# EAGLE schematic Mainboard_LEFT (EAGLE 9.6.2)
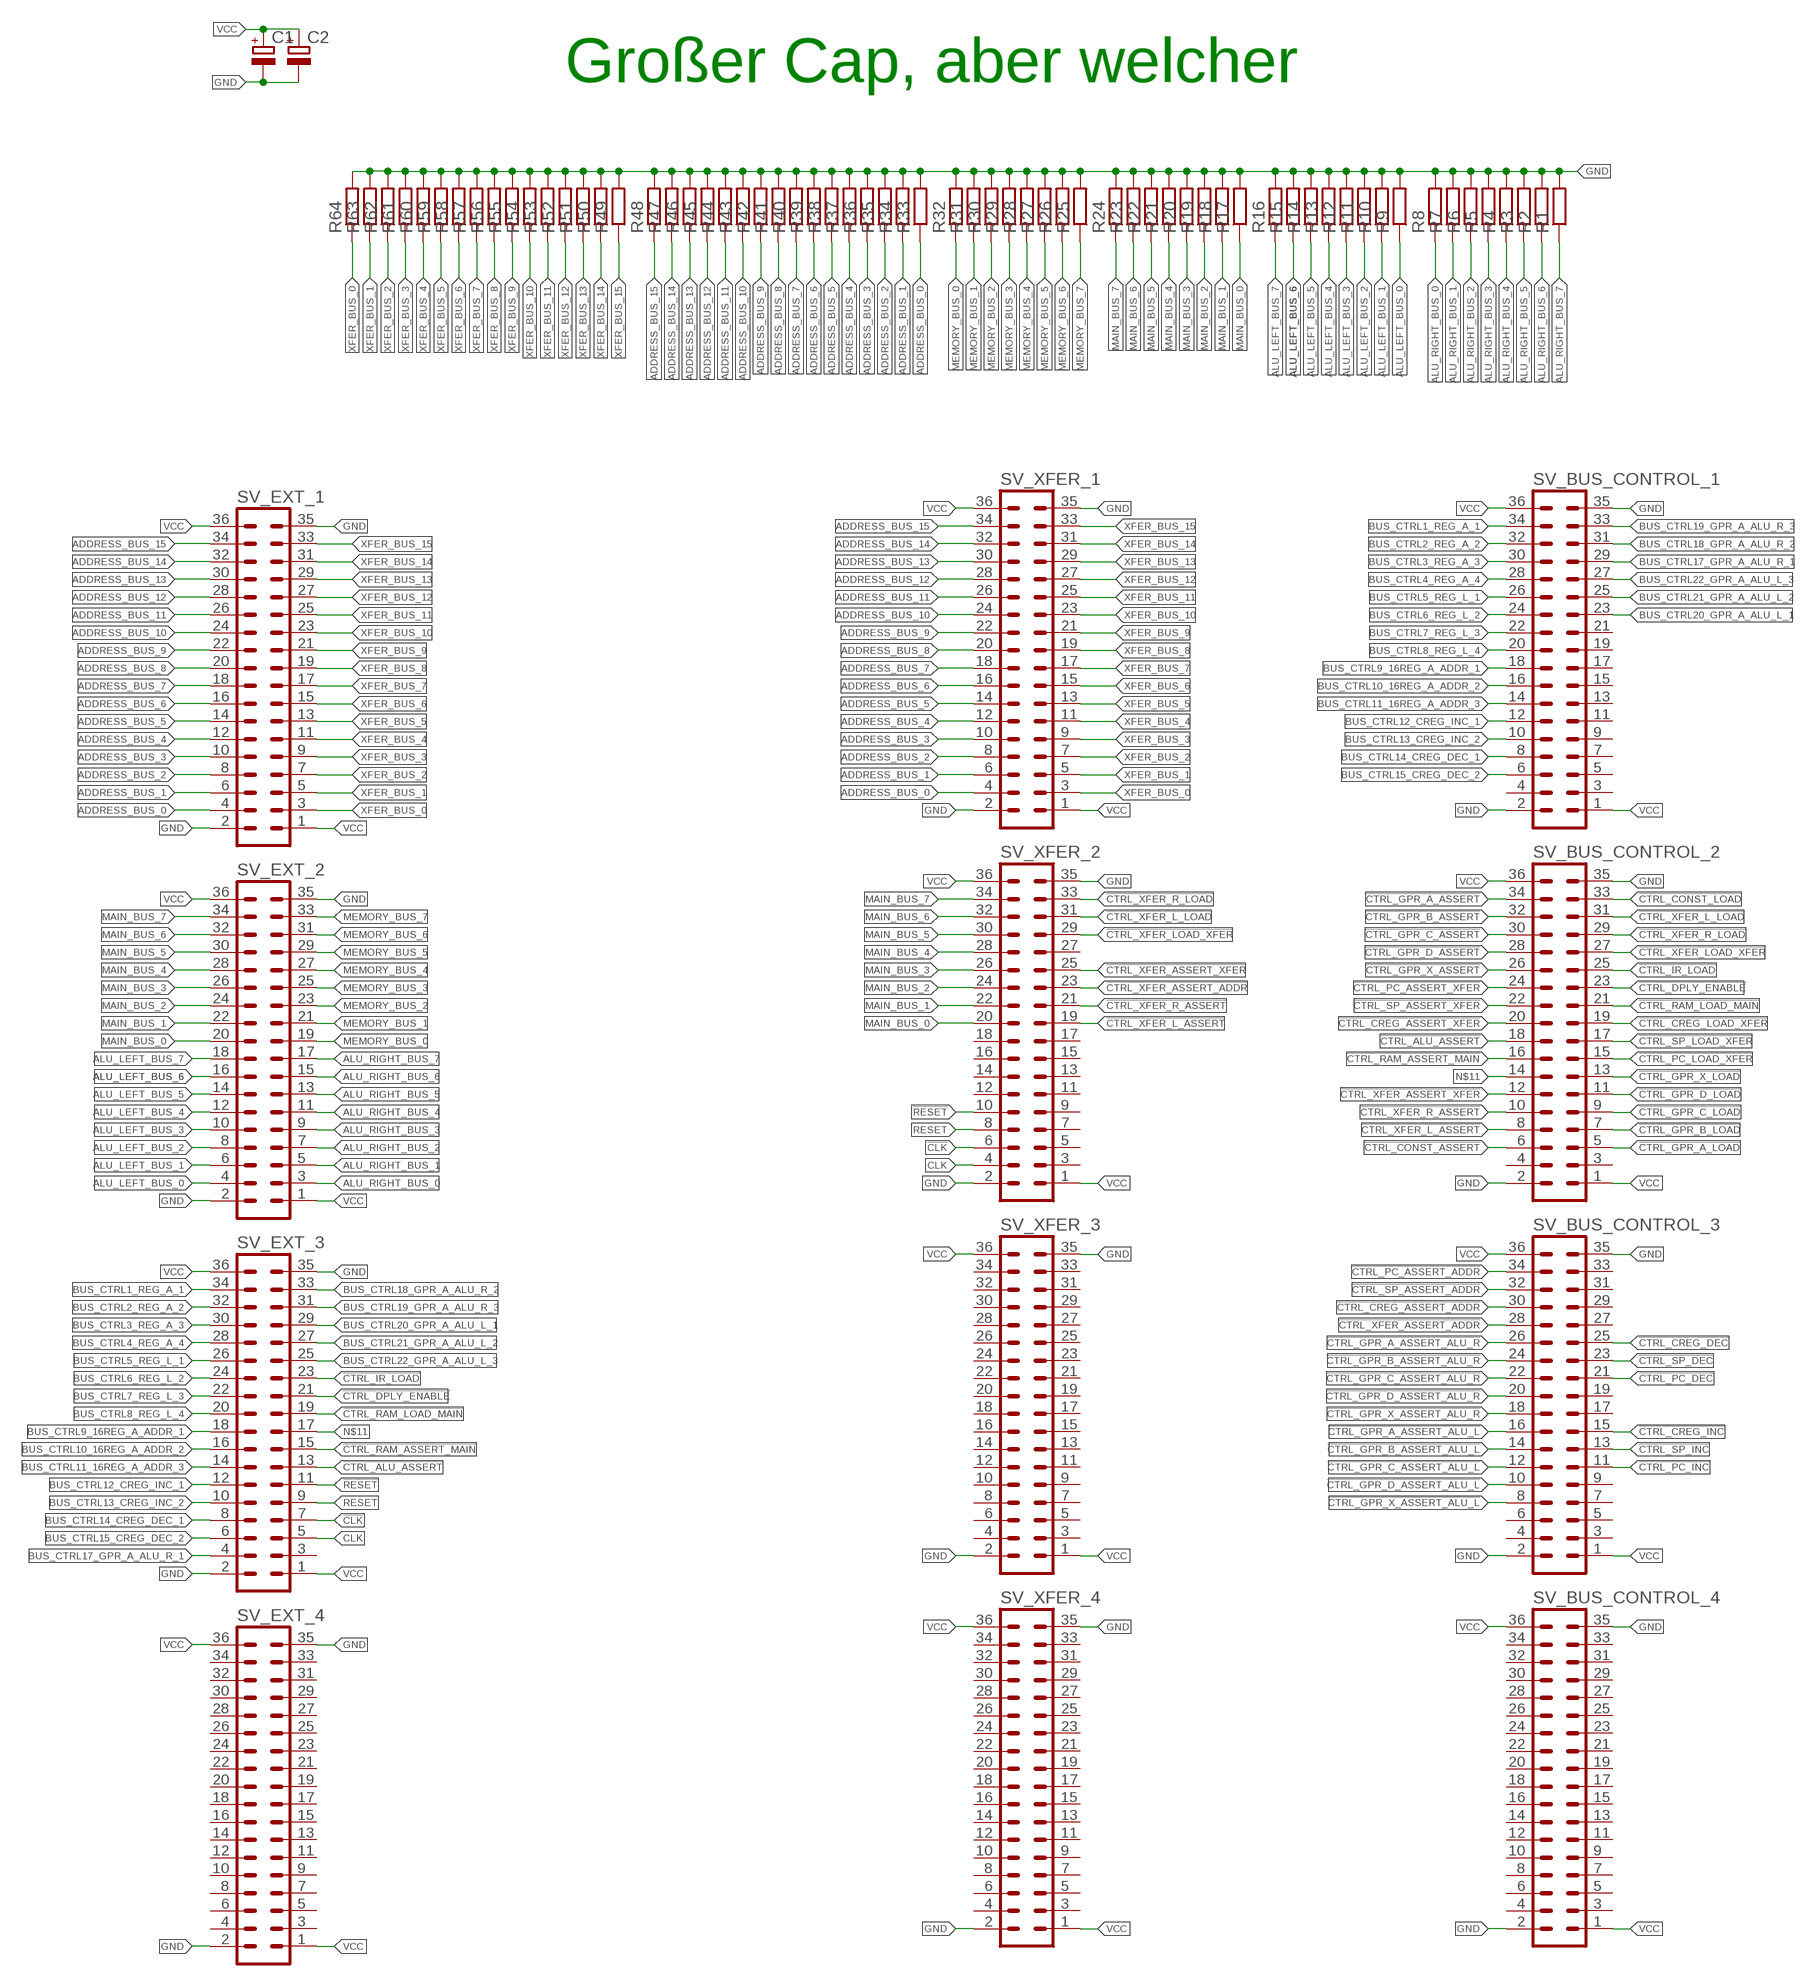
[diagram p0: schematic, sheet 1, part 1 of 2]
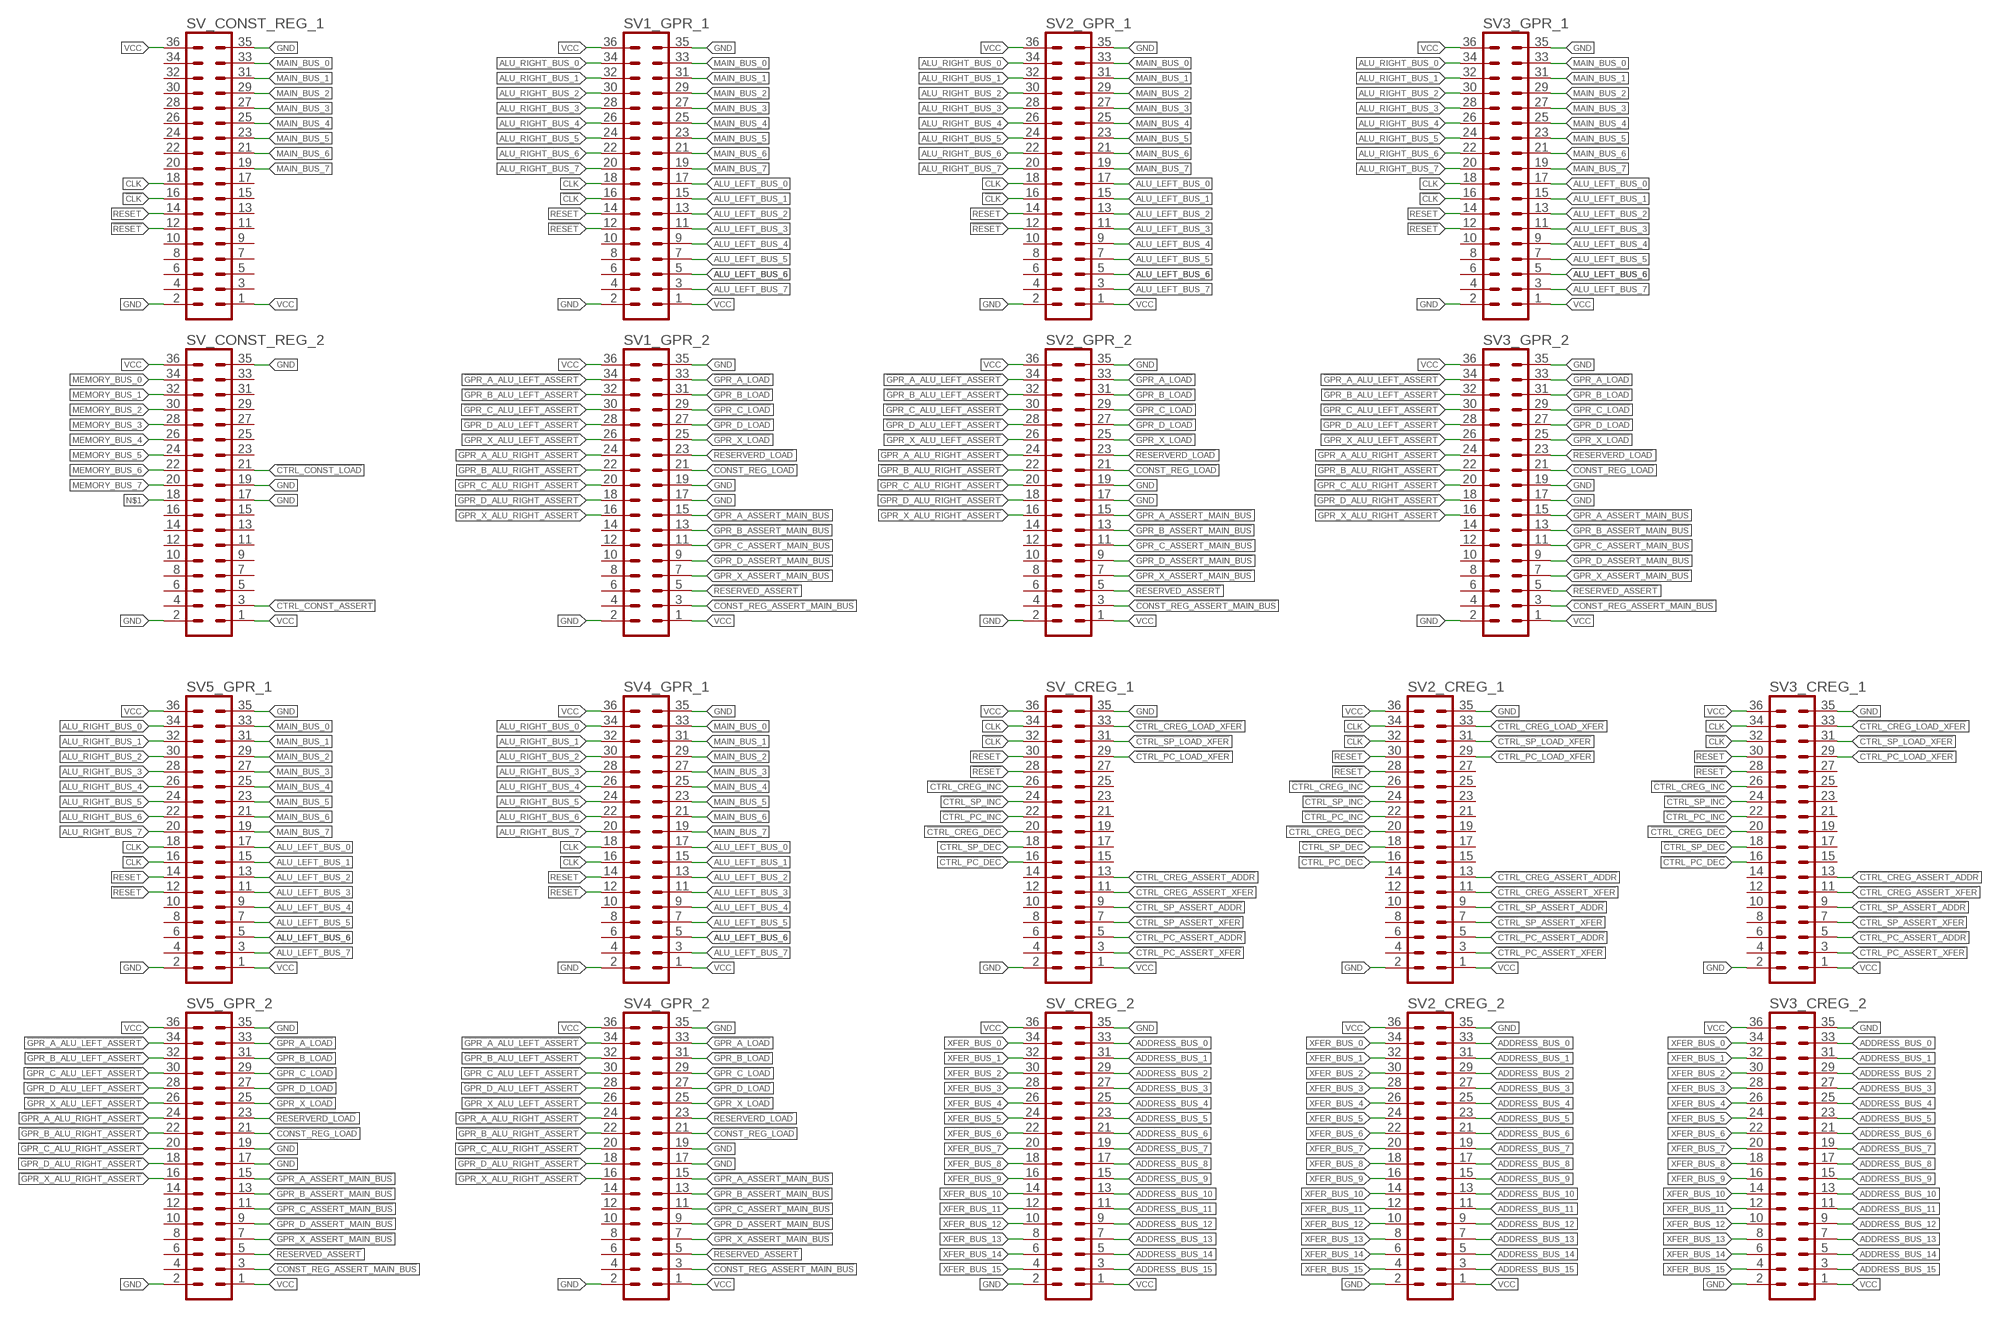
[diagram p1: schematic, sheet 1, part 2 of 2]

## Parts
C1  CPOL-EUE5-10.5  [E5-10,5]
C2  CPOL-EUE5-10.5  [E5-10,5]
R1  R-EU_R0805  [R0805]
R2  R-EU_R0805  [R0805]
R3  R-EU_R0805  [R0805]
R4  R-EU_R0805  [R0805]
R5  R-EU_R0805  [R0805]
R6  R-EU_R0805  [R0805]
R7  R-EU_R0805  [R0805]
R8  R-EU_R0805  [R0805]
R9  R-EU_R0805  [R0805]
R10  R-EU_R0805  [R0805]
R11  R-EU_R0805  [R0805]
R12  R-EU_R0805  [R0805]
R13  R-EU_R0805  [R0805]
R14  R-EU_R0805  [R0805]
R15  R-EU_R0805  [R0805]
R16  R-EU_R0805  [R0805]
R17  R-EU_R0805  [R0805]
R18  R-EU_R0805  [R0805]
R19  R-EU_R0805  [R0805]
R20  R-EU_R0805  [R0805]
R21  R-EU_R0805  [R0805]
R22  R-EU_R0805  [R0805]
R23  R-EU_R0805  [R0805]
R24  R-EU_R0805  [R0805]
R25  R-EU_R0805  [R0805]
R26  R-EU_R0805  [R0805]
R27  R-EU_R0805  [R0805]
R28  R-EU_R0805  [R0805]
R29  R-EU_R0805  [R0805]
R30  R-EU_R0805  [R0805]
R31  R-EU_R0805  [R0805]
R32  R-EU_R0805  [R0805]
R33  R-EU_R0805  [R0805]
R34  R-EU_R0805  [R0805]
R35  R-EU_R0805  [R0805]
R36  R-EU_R0805  [R0805]
R37  R-EU_R0805  [R0805]
R38  R-EU_R0805  [R0805]
R39  R-EU_R0805  [R0805]
R40  R-EU_R0805  [R0805]
R41  R-EU_R0805  [R0805]
R42  R-EU_R0805  [R0805]
R43  R-EU_R0805  [R0805]
R44  R-EU_R0805  [R0805]
R45  R-EU_R0805  [R0805]
R46  R-EU_R0805  [R0805]
R47  R-EU_R0805  [R0805]
R48  R-EU_R0805  [R0805]
R49  R-EU_R0805  [R0805]
R50  R-EU_R0805  [R0805]
R51  R-EU_R0805  [R0805]
R52  R-EU_R0805  [R0805]
R53  R-EU_R0805  [R0805]
R54  R-EU_R0805  [R0805]
R55  R-EU_R0805  [R0805]
R56  R-EU_R0805  [R0805]
R57  R-EU_R0805  [R0805]
R58  R-EU_R0805  [R0805]
R59  R-EU_R0805  [R0805]
R60  R-EU_R0805  [R0805]
R61  R-EU_R0805  [R0805]
R62  R-EU_R0805  [R0805]
R63  R-EU_R0805  [R0805]
R64  R-EU_R0805  [R0805]
SV1_GPR_1  MA18-2  [MA18-2]
SV1_GPR_2  MA18-2  [MA18-2]
SV2_CREG_1  MA18-2  [MA18-2]
SV2_CREG_2  MA18-2  [MA18-2]
SV2_GPR_1  MA18-2  [MA18-2]
SV2_GPR_2  MA18-2  [MA18-2]
SV3_CREG_1  MA18-2  [MA18-2]
SV3_CREG_2  MA18-2  [MA18-2]
SV3_GPR_1  MA18-2  [MA18-2]
SV3_GPR_2  MA18-2  [MA18-2]
SV4_GPR_1  MA18-2  [MA18-2]
SV4_GPR_2  MA18-2  [MA18-2]
SV5_GPR_1  MA18-2  [MA18-2]
SV5_GPR_2  MA18-2  [MA18-2]
SV_BUS_CONTROL_1  MA18-2  [MA18-2]
SV_BUS_CONTROL_2  MA18-2  [MA18-2]
SV_BUS_CONTROL_3  MA18-2  [MA18-2]
SV_BUS_CONTROL_4  MA18-2  [MA18-2]
SV_CONST_REG_1  MA18-2  [MA18-2]
SV_CONST_REG_2  MA18-2  [MA18-2]
SV_CREG_1  MA18-2  [MA18-2]
SV_CREG_2  MA18-2  [MA18-2]
SV_EXT_1  MA18-2W  [MA18-2W]
SV_EXT_2  MA18-2W  [MA18-2W]
SV_EXT_3  MA18-2W  [MA18-2W]
SV_EXT_4  MA18-2W  [MA18-2W]
SV_XFER_1  MA18-2  [MA18-2]
SV_XFER_2  MA18-2  [MA18-2]
SV_XFER_3  MA18-2  [MA18-2]
SV_XFER_4  MA18-2  [MA18-2]

## Nets
!CLK: SV1_GPR_1.16 SV2_CREG_1.32 SV2_GPR_1.16 SV3_CREG_1.32 SV3_GPR_1.16 SV4_GPR_1.16 SV5_GPR_1.16 SV_CONST_REG_1.16 SV_CREG_1.32 SV_EXT_3.7 SV_XFER_2.6
!CONST_REG_ASSERT_MAIN_BUS: SV1_GPR_2.3 SV2_GPR_2.3 SV3_GPR_2.3 SV4_GPR_2.3 SV5_GPR_2.3
!CONST_REG_LOAD: SV1_GPR_2.21 SV2_GPR_2.21 SV3_GPR_2.21 SV4_GPR_2.21 SV5_GPR_2.21
!CTRL_ALU_ASSERT: SV_BUS_CONTROL_2.18 SV_EXT_3.13
!CTRL_CONST_ASSERT: SV_BUS_CONTROL_2.6 SV_CONST_REG_2.3
!CTRL_CONST_LOAD: SV_BUS_CONTROL_2.33 SV_CONST_REG_2.21
!CTRL_CREG_ASSERT_ADDR: SV2_CREG_1.13 SV3_CREG_1.13 SV_BUS_CONTROL_3.30 SV_CREG_1.13
!CTRL_CREG_ASSERT_XFER: SV2_CREG_1.11 SV3_CREG_1.11 SV_BUS_CONTROL_2.20 SV_CREG_1.11
!CTRL_CREG_DEC: SV2_CREG_1.20 SV3_CREG_1.20 SV_BUS_CONTROL_3.25 SV_CREG_1.20
!CTRL_CREG_INC: SV2_CREG_1.26 SV3_CREG_1.26 SV_BUS_CONTROL_3.15 SV_CREG_1.26
!CTRL_CREG_LOAD_XFER: SV2_CREG_1.33 SV3_CREG_1.33 SV_BUS_CONTROL_2.19 SV_CREG_1.33
!CTRL_DPLY_ENABLE: SV_BUS_CONTROL_2.23 SV_EXT_3.21
!CTRL_GPR_A_ASSERT: SV_BUS_CONTROL_2.34
!CTRL_GPR_A_ASSERT_ALU_L: SV_BUS_CONTROL_3.16
!CTRL_GPR_A_ASSERT_ALU_R: SV_BUS_CONTROL_3.26
!CTRL_GPR_A_LOAD: SV_BUS_CONTROL_2.5
!CTRL_GPR_B_ASSERT: SV_BUS_CONTROL_2.32
!CTRL_GPR_B_ASSERT_ALU_L: SV_BUS_CONTROL_3.14
!CTRL_GPR_B_ASSERT_ALU_R: SV_BUS_CONTROL_3.24
!CTRL_GPR_B_LOAD: SV_BUS_CONTROL_2.7
!CTRL_GPR_C_ASSERT: SV_BUS_CONTROL_2.30
!CTRL_GPR_C_ASSERT_ALU_L: SV_BUS_CONTROL_3.12
!CTRL_GPR_C_ASSERT_ALU_R: SV_BUS_CONTROL_3.22
!CTRL_GPR_C_LOAD: SV_BUS_CONTROL_2.9
!CTRL_GPR_D_ASSERT: SV_BUS_CONTROL_2.28
!CTRL_GPR_D_ASSERT_ALU_L: SV_BUS_CONTROL_3.10
!CTRL_GPR_D_ASSERT_ALU_R: SV_BUS_CONTROL_3.20
!CTRL_GPR_D_LOAD: SV_BUS_CONTROL_2.11
!CTRL_GPR_X_ASSERT: SV_BUS_CONTROL_2.26
!CTRL_GPR_X_ASSERT_ALU_L: SV_BUS_CONTROL_3.8
!CTRL_GPR_X_ASSERT_ALU_R: SV_BUS_CONTROL_3.18
!CTRL_GPR_X_LOAD: SV_BUS_CONTROL_2.13
!CTRL_IR_LOAD: SV_BUS_CONTROL_2.25 SV_EXT_3.23
!CTRL_PC_ASSERT_ADDR: SV2_CREG_1.5 SV3_CREG_1.5 SV_BUS_CONTROL_3.34 SV_CREG_1.5
!CTRL_PC_ASSERT_XFER: SV2_CREG_1.3 SV3_CREG_1.3 SV_BUS_CONTROL_2.24 SV_CREG_1.3
!CTRL_PC_DEC: SV2_CREG_1.16 SV3_CREG_1.16 SV_BUS_CONTROL_3.21 SV_CREG_1.16
!CTRL_PC_INC: SV2_CREG_1.22 SV3_CREG_1.22 SV_BUS_CONTROL_3.11 SV_CREG_1.22
!CTRL_PC_LOAD_XFER: SV2_CREG_1.29 SV3_CREG_1.29 SV_BUS_CONTROL_2.15 SV_CREG_1.29
!CTRL_RAM_ASSERT_MAIN: SV_BUS_CONTROL_2.16 SV_EXT_3.15
!CTRL_RAM_LOAD_MAIN: SV_BUS_CONTROL_2.21 SV_EXT_3.19
!CTRL_SP_ASSERT_ADDR: SV2_CREG_1.9 SV3_CREG_1.9 SV_BUS_CONTROL_3.32 SV_CREG_1.9
!CTRL_SP_ASSERT_XFER: SV2_CREG_1.7 SV3_CREG_1.7 SV_BUS_CONTROL_2.22 SV_CREG_1.7
!CTRL_SP_DEC: SV2_CREG_1.18 SV3_CREG_1.18 SV_BUS_CONTROL_3.23 SV_CREG_1.18
!CTRL_SP_INC: SV2_CREG_1.24 SV3_CREG_1.24 SV_BUS_CONTROL_3.13 SV_CREG_1.24
!CTRL_SP_LOAD_XFER: SV2_CREG_1.31 SV3_CREG_1.31 SV_BUS_CONTROL_2.17 SV_CREG_1.31
!CTRL_XFER_ASSERT_ADDR: SV_BUS_CONTROL_3.28 SV_XFER_2.23
!CTRL_XFER_ASSERT_XFER: SV_BUS_CONTROL_2.12 SV_XFER_2.25
!CTRL_XFER_L_ASSERT: SV_BUS_CONTROL_2.8 SV_XFER_2.19
!CTRL_XFER_L_LOAD: SV_BUS_CONTROL_2.31 SV_XFER_2.31
!CTRL_XFER_LOAD_XFER: SV_BUS_CONTROL_2.27 SV_XFER_2.29
!CTRL_XFER_R_ASSERT: SV_BUS_CONTROL_2.10 SV_XFER_2.21
!CTRL_XFER_R_LOAD: SV_BUS_CONTROL_2.29 SV_XFER_2.33
!GPR_A_ALU_LEFT_ASSERT: SV1_GPR_2.34 SV2_GPR_2.34 SV3_GPR_2.34 SV4_GPR_2.34 SV5_GPR_2.34
!GPR_A_ALU_RIGHT_ASSERT: SV1_GPR_2.24 SV2_GPR_2.24 SV3_GPR_2.24 SV4_GPR_2.24 SV5_GPR_2.24
!GPR_A_ASSERT_MAIN_BUS: SV1_GPR_2.15 SV2_GPR_2.15 SV3_GPR_2.15 SV4_GPR_2.15 SV5_GPR_2.15
!GPR_A_LOAD: SV1_GPR_2.33 SV2_GPR_2.33 SV3_GPR_2.33 SV4_GPR_2.33 SV5_GPR_2.33
!GPR_B_ALU_LEFT_ASSERT: SV1_GPR_2.32 SV2_GPR_2.32 SV3_GPR_2.32 SV4_GPR_2.32 SV5_GPR_2.32
!GPR_B_ALU_RIGHT_ASSERT: SV1_GPR_2.22 SV2_GPR_2.22 SV3_GPR_2.22 SV4_GPR_2.22 SV5_GPR_2.22
!GPR_B_ASSERT_MAIN_BUS: SV1_GPR_2.13 SV2_GPR_2.13 SV3_GPR_2.13 SV4_GPR_2.13 SV5_GPR_2.13
!GPR_B_LOAD: SV1_GPR_2.31 SV2_GPR_2.31 SV3_GPR_2.31 SV4_GPR_2.31 SV5_GPR_2.31
!GPR_C_ALU_LEFT_ASSERT: SV1_GPR_2.30 SV2_GPR_2.30 SV3_GPR_2.30 SV4_GPR_2.30 SV5_GPR_2.30
!GPR_C_ALU_RIGHT_ASSERT: SV1_GPR_2.20 SV2_GPR_2.20 SV3_GPR_2.20 SV4_GPR_2.20 SV5_GPR_2.20
!GPR_C_ASSERT_MAIN_BUS: SV1_GPR_2.11 SV2_GPR_2.11 SV3_GPR_2.11 SV4_GPR_2.11 SV5_GPR_2.11
!GPR_C_LOAD: SV1_GPR_2.29 SV2_GPR_2.29 SV3_GPR_2.29 SV4_GPR_2.29 SV5_GPR_2.29
!GPR_D_ALU_LEFT_ASSERT: SV1_GPR_2.28 SV2_GPR_2.28 SV3_GPR_2.28 SV4_GPR_2.28 SV5_GPR_2.28
!GPR_D_ALU_RIGHT_ASSERT: SV1_GPR_2.18 SV2_GPR_2.18 SV3_GPR_2.18 SV4_GPR_2.18 SV5_GPR_2.18
!GPR_D_ASSERT_MAIN_BUS: SV1_GPR_2.9 SV2_GPR_2.9 SV3_GPR_2.9 SV4_GPR_2.9 SV5_GPR_2.9
!GPR_D_LOAD: SV1_GPR_2.27 SV2_GPR_2.27 SV3_GPR_2.27 SV4_GPR_2.27 SV5_GPR_2.27
!GPR_X_ALU_LEFT_ASSERT: SV1_GPR_2.26 SV2_GPR_2.26 SV3_GPR_2.26 SV4_GPR_2.26 SV5_GPR_2.26
!GPR_X_ALU_RIGHT_ASSERT: SV1_GPR_2.16 SV2_GPR_2.16 SV3_GPR_2.16 SV4_GPR_2.16 SV5_GPR_2.16
!GPR_X_ASSERT_MAIN_BUS: SV1_GPR_2.7 SV2_GPR_2.7 SV3_GPR_2.7 SV4_GPR_2.7 SV5_GPR_2.7
!GPR_X_LOAD: SV1_GPR_2.25 SV2_GPR_2.25 SV3_GPR_2.25 SV4_GPR_2.25 SV5_GPR_2.25
!RESERVED_ASSERT: SV1_GPR_2.5 SV2_GPR_2.5 SV3_GPR_2.5 SV4_GPR_2.5 SV5_GPR_2.5
!RESERVERD_LOAD: SV1_GPR_2.23 SV2_GPR_2.23 SV3_GPR_2.23 SV4_GPR_2.23 SV5_GPR_2.23
!RESET: SV1_GPR_1.12 SV2_CREG_1.28 SV2_GPR_1.12 SV3_CREG_1.28 SV3_GPR_1.12 SV4_GPR_1.12 SV5_GPR_1.12 SV_CONST_REG_1.12 SV_CREG_1.28 SV_EXT_3.11 SV_XFER_2.10
ADDRESS_BUS_0: R33.1 SV2_CREG_2.33 SV3_CREG_2.33 SV_CREG_2.33 SV_EXT_1.4 SV_XFER_1.4
ADDRESS_BUS_1: R34.1 SV2_CREG_2.31 SV3_CREG_2.31 SV_CREG_2.31 SV_EXT_1.6 SV_XFER_1.6
ADDRESS_BUS_2: R35.1 SV2_CREG_2.29 SV3_CREG_2.29 SV_CREG_2.29 SV_EXT_1.8 SV_XFER_1.8
ADDRESS_BUS_3: R36.1 SV2_CREG_2.27 SV3_CREG_2.27 SV_CREG_2.27 SV_EXT_1.10 SV_XFER_1.10
ADDRESS_BUS_4: R37.1 SV2_CREG_2.25 SV3_CREG_2.25 SV_CREG_2.25 SV_EXT_1.12 SV_XFER_1.12
ADDRESS_BUS_5: R38.1 SV2_CREG_2.23 SV3_CREG_2.23 SV_CREG_2.23 SV_EXT_1.14 SV_XFER_1.14
ADDRESS_BUS_6: R39.1 SV2_CREG_2.21 SV3_CREG_2.21 SV_CREG_2.21 SV_EXT_1.16 SV_XFER_1.16
ADDRESS_BUS_7: R40.1 SV2_CREG_2.19 SV3_CREG_2.19 SV_CREG_2.19 SV_EXT_1.18 SV_XFER_1.18
ADDRESS_BUS_8: R41.1 SV2_CREG_2.17 SV3_CREG_2.17 SV_CREG_2.17 SV_EXT_1.20 SV_XFER_1.20
ADDRESS_BUS_9: R42.1 SV2_CREG_2.15 SV3_CREG_2.15 SV_CREG_2.15 SV_EXT_1.22 SV_XFER_1.22
ADDRESS_BUS_10: R43.1 SV2_CREG_2.13 SV3_CREG_2.13 SV_CREG_2.13 SV_EXT_1.24 SV_XFER_1.24
ADDRESS_BUS_11: R44.1 SV2_CREG_2.11 SV3_CREG_2.11 SV_CREG_2.11 SV_EXT_1.26 SV_XFER_1.26
ADDRESS_BUS_12: R45.1 SV2_CREG_2.9 SV3_CREG_2.9 SV_CREG_2.9 SV_EXT_1.28 SV_XFER_1.28
ADDRESS_BUS_13: R46.1 SV2_CREG_2.7 SV3_CREG_2.7 SV_CREG_2.7 SV_EXT_1.30 SV_XFER_1.30
ADDRESS_BUS_14: R47.1 SV2_CREG_2.5 SV3_CREG_2.5 SV_CREG_2.5 SV_EXT_1.32 SV_XFER_1.32
ADDRESS_BUS_15: R48.1 SV2_CREG_2.3 SV3_CREG_2.3 SV_CREG_2.3 SV_EXT_1.34 SV_XFER_1.34
ALU_LEFT_BUS_0: R9.1 SV1_GPR_1.17 SV2_GPR_1.17 SV3_GPR_1.17 SV4_GPR_1.17 SV5_GPR_1.17 SV_EXT_2.4
ALU_LEFT_BUS_1: R10.1 SV1_GPR_1.15 SV2_GPR_1.15 SV3_GPR_1.15 SV4_GPR_1.15 SV5_GPR_1.15 SV_EXT_2.6
ALU_LEFT_BUS_2: R11.1 SV1_GPR_1.13 SV2_GPR_1.13 SV3_GPR_1.13 SV4_GPR_1.13 SV5_GPR_1.13 SV_EXT_2.8
ALU_LEFT_BUS_3: R12.1 SV1_GPR_1.11 SV2_GPR_1.11 SV3_GPR_1.11 SV4_GPR_1.11 SV5_GPR_1.11 SV_EXT_2.10
ALU_LEFT_BUS_4: R13.1 SV1_GPR_1.9 SV2_GPR_1.9 SV3_GPR_1.9 SV4_GPR_1.9 SV5_GPR_1.9 SV_EXT_2.12
ALU_LEFT_BUS_5: R14.1 SV1_GPR_1.7 SV2_GPR_1.7 SV3_GPR_1.7 SV4_GPR_1.7 SV5_GPR_1.7 SV_EXT_2.14
ALU_LEFT_BUS_6: R15.1 SV1_GPR_1.5 SV2_GPR_1.5 SV3_GPR_1.5 SV4_GPR_1.5 SV5_GPR_1.5 SV_EXT_2.16
ALU_LEFT_BUS_7: R16.1 SV1_GPR_1.3 SV2_GPR_1.3 SV3_GPR_1.3 SV4_GPR_1.3 SV5_GPR_1.3 SV_EXT_2.18
ALU_RIGHT_BUS_0: R8.1 SV1_GPR_1.34 SV2_GPR_1.34 SV3_GPR_1.34 SV4_GPR_1.34 SV5_GPR_1.34 SV_EXT_2.3
ALU_RIGHT_BUS_1: R7.1 SV1_GPR_1.32 SV2_GPR_1.32 SV3_GPR_1.32 SV4_GPR_1.32 SV5_GPR_1.32 SV_EXT_2.5
ALU_RIGHT_BUS_2: R6.1 SV1_GPR_1.30 SV2_GPR_1.30 SV3_GPR_1.30 SV4_GPR_1.30 SV5_GPR_1.30 SV_EXT_2.7
ALU_RIGHT_BUS_3: R5.1 SV1_GPR_1.28 SV2_GPR_1.28 SV3_GPR_1.28 SV4_GPR_1.28 SV5_GPR_1.28 SV_EXT_2.9
ALU_RIGHT_BUS_4: R4.1 SV1_GPR_1.26 SV2_GPR_1.26 SV3_GPR_1.26 SV4_GPR_1.26 SV5_GPR_1.26 SV_EXT_2.11
ALU_RIGHT_BUS_5: R3.1 SV1_GPR_1.24 SV2_GPR_1.24 SV3_GPR_1.24 SV4_GPR_1.24 SV5_GPR_1.24 SV_EXT_2.13
ALU_RIGHT_BUS_6: R2.1 SV1_GPR_1.22 SV2_GPR_1.22 SV3_GPR_1.22 SV4_GPR_1.22 SV5_GPR_1.22 SV_EXT_2.15
ALU_RIGHT_BUS_7: R1.1 SV1_GPR_1.20 SV2_GPR_1.20 SV3_GPR_1.20 SV4_GPR_1.20 SV5_GPR_1.20 SV_EXT_2.17
BUS_CTRL1_REG_A_1: SV_BUS_CONTROL_1.34 SV_EXT_3.34
BUS_CTRL2_REG_A_2: SV_BUS_CONTROL_1.32 SV_EXT_3.32
BUS_CTRL3_REG_A_3: SV_BUS_CONTROL_1.30 SV_EXT_3.30
BUS_CTRL4_REG_A_4: SV_BUS_CONTROL_1.28 SV_EXT_3.28
BUS_CTRL5_REG_L_1: SV_BUS_CONTROL_1.26 SV_EXT_3.26
BUS_CTRL6_REG_L_2: SV_BUS_CONTROL_1.24 SV_EXT_3.24
BUS_CTRL7_REG_L_3: SV_BUS_CONTROL_1.22 SV_EXT_3.22
BUS_CTRL8_REG_L_4: SV_BUS_CONTROL_1.20 SV_EXT_3.20
BUS_CTRL9_16REG_A_ADDR_1: SV_BUS_CONTROL_1.18 SV_EXT_3.18
BUS_CTRL10_16REG_A_ADDR_2: SV_BUS_CONTROL_1.16 SV_EXT_3.16
BUS_CTRL11_16REG_A_ADDR_3: SV_BUS_CONTROL_1.14 SV_EXT_3.14
BUS_CTRL12_CREG_INC_1: SV_BUS_CONTROL_1.12 SV_EXT_3.12
BUS_CTRL13_CREG_INC_2: SV_BUS_CONTROL_1.10 SV_EXT_3.10
BUS_CTRL14_CREG_DEC_1: SV_BUS_CONTROL_1.8 SV_EXT_3.8
BUS_CTRL15_CREG_DEC_2: SV_BUS_CONTROL_1.6 SV_EXT_3.6
BUS_CTRL17_GPR_A_ALU_R_1: SV_BUS_CONTROL_1.29 SV_EXT_3.4
BUS_CTRL18_GPR_A_ALU_R_2: SV_BUS_CONTROL_1.31 SV_EXT_3.33
BUS_CTRL19_GPR_A_ALU_R_3: SV_BUS_CONTROL_1.33 SV_EXT_3.31
BUS_CTRL20_GPR_A_ALU_L_1: SV_BUS_CONTROL_1.23 SV_EXT_3.29
BUS_CTRL21_GPR_A_ALU_L_2: SV_BUS_CONTROL_1.25 SV_EXT_3.27
BUS_CTRL22_GPR_A_ALU_L_3: SV_BUS_CONTROL_1.27 SV_EXT_3.25
CLK: SV1_GPR_1.18 SV2_CREG_1.34 SV2_GPR_1.18 SV3_CREG_1.34 SV3_GPR_1.18 SV4_GPR_1.18 SV5_GPR_1.18 SV_CONST_REG_1.18 SV_CREG_1.34 SV_EXT_3.5 SV_XFER_2.4
GND: C1.- C2.- R1.2 R2.2 R3.2 R4.2 R5.2 R6.2 R7.2 R8.2 R9.2 R10.2 R11.2 R12.2 R13.2 R14.2 R15.2 R16.2 R17.2 R18.2 R19.2 R20.2 R21.2 R22.2 R23.2 R24.2 R25.2 R26.2 R27.2 R28.2 R29.2 R30.2 R31.2 R32.2 R33.2 R34.2 R35.2 R36.2 R37.2 R38.2 R39.2 R40.2 R41.2 R42.2 R43.2 R44.2 R45.2 R46.2 R47.2 R48.2 R49.2 R50.2 R51.2 R52.2 R53.2 R54.2 R55.2 R56.2 R57.2 R58.2 R59.2 R60.2 R61.2 R62.2 R63.2 R64.2 SV1_GPR_1.2 SV1_GPR_1.35 SV1_GPR_2.2 SV1_GPR_2.17 SV1_GPR_2.19 SV1_GPR_2.35 SV2_CREG_1.2 SV2_CREG_1.35 SV2_CREG_2.2 SV2_CREG_2.35 SV2_GPR_1.2 SV2_GPR_1.35 SV2_GPR_2.2 SV2_GPR_2.17 SV2_GPR_2.19 SV2_GPR_2.35 SV3_CREG_1.2 SV3_CREG_1.35 SV3_CREG_2.2 SV3_CREG_2.35 SV3_GPR_1.2 SV3_GPR_1.35 SV3_GPR_2.2 SV3_GPR_2.17 SV3_GPR_2.19 SV3_GPR_2.35 SV4_GPR_1.2 SV4_GPR_1.35 SV4_GPR_2.2 SV4_GPR_2.17 SV4_GPR_2.19 SV4_GPR_2.35 SV5_GPR_1.2 SV5_GPR_1.35 SV5_GPR_2.2 SV5_GPR_2.17 SV5_GPR_2.19 SV5_GPR_2.35 SV_BUS_CONTROL_1.2 SV_BUS_CONTROL_1.35 SV_BUS_CONTROL_2.2 SV_BUS_CONTROL_2.35 SV_BUS_CONTROL_3.2 SV_BUS_CONTROL_3.35 SV_BUS_CONTROL_4.2 SV_BUS_CONTROL_4.35 SV_CONST_REG_1.2 SV_CONST_REG_1.35 SV_CONST_REG_2.2 SV_CONST_REG_2.17 SV_CONST_REG_2.19 SV_CONST_REG_2.35 SV_CREG_1.2 SV_CREG_1.35 SV_CREG_2.2 SV_CREG_2.35 SV_EXT_1.2 SV_EXT_1.35 SV_EXT_2.2 SV_EXT_2.35 SV_EXT_3.2 SV_EXT_3.35 SV_EXT_4.2 SV_EXT_4.35 SV_XFER_1.2 SV_XFER_1.35 SV_XFER_2.2 SV_XFER_2.35 SV_XFER_3.2 SV_XFER_3.35 SV_XFER_4.2 SV_XFER_4.35
MAIN_BUS_0: R17.1 SV1_GPR_1.33 SV2_GPR_1.33 SV3_GPR_1.33 SV4_GPR_1.33 SV5_GPR_1.33 SV_CONST_REG_1.33 SV_EXT_2.20 SV_XFER_2.20
MAIN_BUS_1: R18.1 SV1_GPR_1.31 SV2_GPR_1.31 SV3_GPR_1.31 SV4_GPR_1.31 SV5_GPR_1.31 SV_CONST_REG_1.31 SV_EXT_2.22 SV_XFER_2.22
MAIN_BUS_2: R19.1 SV1_GPR_1.29 SV2_GPR_1.29 SV3_GPR_1.29 SV4_GPR_1.29 SV5_GPR_1.29 SV_CONST_REG_1.29 SV_EXT_2.24 SV_XFER_2.24
MAIN_BUS_3: R20.1 SV1_GPR_1.27 SV2_GPR_1.27 SV3_GPR_1.27 SV4_GPR_1.27 SV5_GPR_1.27 SV_CONST_REG_1.27 SV_EXT_2.26 SV_XFER_2.26
MAIN_BUS_4: R21.1 SV1_GPR_1.25 SV2_GPR_1.25 SV3_GPR_1.25 SV4_GPR_1.25 SV5_GPR_1.25 SV_CONST_REG_1.25 SV_EXT_2.28 SV_XFER_2.28
MAIN_BUS_5: R22.1 SV1_GPR_1.23 SV2_GPR_1.23 SV3_GPR_1.23 SV4_GPR_1.23 SV5_GPR_1.23 SV_CONST_REG_1.23 SV_EXT_2.30 SV_XFER_2.30
MAIN_BUS_6: R23.1 SV1_GPR_1.21 SV2_GPR_1.21 SV3_GPR_1.21 SV4_GPR_1.21 SV5_GPR_1.21 SV_CONST_REG_1.21 SV_EXT_2.32 SV_XFER_2.32
MAIN_BUS_7: R24.1 SV1_GPR_1.19 SV2_GPR_1.19 SV3_GPR_1.19 SV4_GPR_1.19 SV5_GPR_1.19 SV_CONST_REG_1.19 SV_EXT_2.34 SV_XFER_2.34
MEMORY_BUS_0: R32.1 SV_CONST_REG_2.34 SV_EXT_2.19
MEMORY_BUS_1: R31.1 SV_CONST_REG_2.32 SV_EXT_2.21
MEMORY_BUS_2: R30.1 SV_CONST_REG_2.30 SV_EXT_2.23
MEMORY_BUS_3: R29.1 SV_CONST_REG_2.28 SV_EXT_2.25
MEMORY_BUS_4: R28.1 SV_CONST_REG_2.26 SV_EXT_2.27
MEMORY_BUS_5: R27.1 SV_CONST_REG_2.24 SV_EXT_2.29
MEMORY_BUS_6: R26.1 SV_CONST_REG_2.22 SV_EXT_2.31
MEMORY_BUS_7: R25.1 SV_CONST_REG_2.20 SV_EXT_2.33
N$1: SV_CONST_REG_2.18
N$11: SV_BUS_CONTROL_2.14 SV_EXT_3.17
RESET: SV1_GPR_1.14 SV2_CREG_1.30 SV2_GPR_1.14 SV3_CREG_1.30 SV3_GPR_1.14 SV4_GPR_1.14 SV5_GPR_1.14 SV_CONST_REG_1.14 SV_CREG_1.30 SV_EXT_3.9 SV_XFER_2.8
VCC: C1.+ C2.+ SV1_GPR_1.1 SV1_GPR_1.36 SV1_GPR_2.1 SV1_GPR_2.36 SV2_CREG_1.1 SV2_CREG_1.36 SV2_CREG_2.1 SV2_CREG_2.36 SV2_GPR_1.1 SV2_GPR_1.36 SV2_GPR_2.1 SV2_GPR_2.36 SV3_CREG_1.1 SV3_CREG_1.36 SV3_CREG_2.1 SV3_CREG_2.36 SV3_GPR_1.1 SV3_GPR_1.36 SV3_GPR_2.1 SV3_GPR_2.36 SV4_GPR_1.1 SV4_GPR_1.36 SV4_GPR_2.1 SV4_GPR_2.36 SV5_GPR_1.1 SV5_GPR_1.36 SV5_GPR_2.1 SV5_GPR_2.36 SV_BUS_CONTROL_1.1 SV_BUS_CONTROL_1.36 SV_BUS_CONTROL_2.1 SV_BUS_CONTROL_2.36 SV_BUS_CONTROL_3.1 SV_BUS_CONTROL_3.36 SV_BUS_CONTROL_4.1 SV_BUS_CONTROL_4.36 SV_CONST_REG_1.1 SV_CONST_REG_1.36 SV_CONST_REG_2.1 SV_CONST_REG_2.36 SV_CREG_1.1 SV_CREG_1.36 SV_CREG_2.1 SV_CREG_2.36 SV_EXT_1.1 SV_EXT_1.36 SV_EXT_2.1 SV_EXT_2.36 SV_EXT_3.1 SV_EXT_3.36 SV_EXT_4.1 SV_EXT_4.36 SV_XFER_1.1 SV_XFER_1.36 SV_XFER_2.1 SV_XFER_2.36 SV_XFER_3.1 SV_XFER_3.36 SV_XFER_4.1 SV_XFER_4.36
XFER_BUS_0: R64.1 SV2_CREG_2.34 SV3_CREG_2.34 SV_CREG_2.34 SV_EXT_1.3 SV_XFER_1.3
XFER_BUS_1: R63.1 SV2_CREG_2.32 SV3_CREG_2.32 SV_CREG_2.32 SV_EXT_1.5 SV_XFER_1.5
XFER_BUS_2: R62.1 SV2_CREG_2.30 SV3_CREG_2.30 SV_CREG_2.30 SV_EXT_1.7 SV_XFER_1.7
XFER_BUS_3: R61.1 SV2_CREG_2.28 SV3_CREG_2.28 SV_CREG_2.28 SV_EXT_1.9 SV_XFER_1.9
XFER_BUS_4: R60.1 SV2_CREG_2.26 SV3_CREG_2.26 SV_CREG_2.26 SV_EXT_1.11 SV_XFER_1.11
XFER_BUS_5: R59.1 SV2_CREG_2.24 SV3_CREG_2.24 SV_CREG_2.24 SV_EXT_1.13 SV_XFER_1.13
XFER_BUS_6: R58.1 SV2_CREG_2.22 SV3_CREG_2.22 SV_CREG_2.22 SV_EXT_1.15 SV_XFER_1.15
XFER_BUS_7: R57.1 SV2_CREG_2.20 SV3_CREG_2.20 SV_CREG_2.20 SV_EXT_1.17 SV_XFER_1.17
XFER_BUS_8: R56.1 SV2_CREG_2.18 SV3_CREG_2.18 SV_CREG_2.18 SV_EXT_1.19 SV_XFER_1.19
XFER_BUS_9: R55.1 SV2_CREG_2.16 SV3_CREG_2.16 SV_CREG_2.16 SV_EXT_1.21 SV_XFER_1.21
XFER_BUS_10: R54.1 SV2_CREG_2.14 SV3_CREG_2.14 SV_CREG_2.14 SV_EXT_1.23 SV_XFER_1.23
XFER_BUS_11: R53.1 SV2_CREG_2.12 SV3_CREG_2.12 SV_CREG_2.12 SV_EXT_1.25 SV_XFER_1.25
XFER_BUS_12: R52.1 SV2_CREG_2.10 SV3_CREG_2.10 SV_CREG_2.10 SV_EXT_1.27 SV_XFER_1.27
XFER_BUS_13: R51.1 SV2_CREG_2.8 SV3_CREG_2.8 SV_CREG_2.8 SV_EXT_1.29 SV_XFER_1.29
XFER_BUS_14: R50.1 SV2_CREG_2.6 SV3_CREG_2.6 SV_CREG_2.6 SV_EXT_1.31 SV_XFER_1.31
XFER_BUS_15: R49.1 SV2_CREG_2.4 SV3_CREG_2.4 SV_CREG_2.4 SV_EXT_1.33 SV_XFER_1.33
Unconnected: SV1_GPR_1.4 SV1_GPR_1.6 SV1_GPR_1.8 SV1_GPR_1.10 SV1_GPR_2.4 SV1_GPR_2.6 SV1_GPR_2.8 SV1_GPR_2.10 SV1_GPR_2.12 SV1_GPR_2.14 SV2_CREG_1.4 SV2_CREG_1.6 SV2_CREG_1.8 SV2_CREG_1.10 SV2_CREG_1.12 SV2_CREG_1.14 SV2_CREG_1.15 SV2_CREG_1.17 SV2_CREG_1.19 SV2_CREG_1.21 SV2_CREG_1.23 SV2_CREG_1.25 SV2_CREG_1.27 SV2_GPR_1.4 SV2_GPR_1.6 SV2_GPR_1.8 SV2_GPR_1.10 SV2_GPR_2.4 SV2_GPR_2.6 SV2_GPR_2.8 SV2_GPR_2.10 SV2_GPR_2.12 SV2_GPR_2.14 SV3_CREG_1.4 SV3_CREG_1.6 SV3_CREG_1.8 SV3_CREG_1.10 SV3_CREG_1.12 SV3_CREG_1.14 SV3_CREG_1.15 SV3_CREG_1.17 SV3_CREG_1.19 SV3_CREG_1.21 SV3_CREG_1.23 SV3_CREG_1.25 SV3_CREG_1.27 SV3_GPR_1.4 SV3_GPR_1.6 SV3_GPR_1.8 SV3_GPR_1.10 SV3_GPR_2.4 SV3_GPR_2.6 SV3_GPR_2.8 SV3_GPR_2.10 SV3_GPR_2.12 SV3_GPR_2.14 SV4_GPR_1.4 SV4_GPR_1.6 SV4_GPR_1.8 SV4_GPR_1.10 SV4_GPR_2.4 SV4_GPR_2.6 SV4_GPR_2.8 SV4_GPR_2.10 SV4_GPR_2.12 SV4_GPR_2.14 SV5_GPR_1.4 SV5_GPR_1.6 SV5_GPR_1.8 SV5_GPR_1.10 SV5_GPR_2.4 SV5_GPR_2.6 SV5_GPR_2.8 SV5_GPR_2.10 SV5_GPR_2.12 SV5_GPR_2.14 SV_BUS_CONTROL_1.3 SV_BUS_CONTROL_1.4 SV_BUS_CONTROL_1.5 SV_BUS_CONTROL_1.7 SV_BUS_CONTROL_1.9 SV_BUS_CONTROL_1.11 SV_BUS_CONTROL_1.13 SV_BUS_CONTROL_1.15 SV_BUS_CONTROL_1.17 SV_BUS_CONTROL_1.19 SV_BUS_CONTROL_1.21 SV_BUS_CONTROL_2.3 SV_BUS_CONTROL_2.4 SV_BUS_CONTROL_3.3 SV_BUS_CONTROL_3.4 SV_BUS_CONTROL_3.5 SV_BUS_CONTROL_3.6 SV_BUS_CONTROL_3.7 SV_BUS_CONTROL_3.9 SV_BUS_CONTROL_3.17 SV_BUS_CONTROL_3.19 SV_BUS_CONTROL_3.27 SV_BUS_CONTROL_3.29 SV_BUS_CONTROL_3.31 SV_BUS_CONTROL_3.33 SV_BUS_CONTROL_4.3 SV_BUS_CONTROL_4.4 SV_BUS_CONTROL_4.5 SV_BUS_CONTROL_4.6 SV_BUS_CONTROL_4.7 SV_BUS_CONTROL_4.8 SV_BUS_CONTROL_4.9 SV_BUS_CONTROL_4.10 SV_BUS_CONTROL_4.11 SV_BUS_CONTROL_4.12 SV_BUS_CONTROL_4.13 SV_BUS_CONTROL_4.14 SV_BUS_CONTROL_4.15 SV_BUS_CONTROL_4.16 SV_BUS_CONTROL_4.17 SV_BUS_CONTROL_4.18 SV_BUS_CONTROL_4.19 SV_BUS_CONTROL_4.20 SV_BUS_CONTROL_4.21 SV_BUS_CONTROL_4.22 SV_BUS_CONTROL_4.23 SV_BUS_CONTROL_4.24 SV_BUS_CONTROL_4.25 SV_BUS_CONTROL_4.26 SV_BUS_CONTROL_4.27 SV_BUS_CONTROL_4.28 SV_BUS_CONTROL_4.29 SV_BUS_CONTROL_4.30 SV_BUS_CONTROL_4.31 SV_BUS_CONTROL_4.32 SV_BUS_CONTROL_4.33 SV_BUS_CONTROL_4.34 SV_CONST_REG_1.3 SV_CONST_REG_1.4 SV_CONST_REG_1.5 SV_CONST_REG_1.6 SV_CONST_REG_1.7 SV_CONST_REG_1.8 SV_CONST_REG_1.9 SV_CONST_REG_1.10 SV_CONST_REG_1.11 SV_CONST_REG_1.13 SV_CONST_REG_1.15 SV_CONST_REG_1.17 SV_CONST_REG_1.20 SV_CONST_REG_1.22 SV_CONST_REG_1.24 SV_CONST_REG_1.26 SV_CONST_REG_1.28 SV_CONST_REG_1.30 SV_CONST_REG_1.32 SV_CONST_REG_1.34 SV_CONST_REG_2.4 SV_CONST_REG_2.5 SV_CONST_REG_2.6 SV_CONST_REG_2.7 SV_CONST_REG_2.8 SV_CONST_REG_2.9 SV_CONST_REG_2.10 SV_CONST_REG_2.11 SV_CONST_REG_2.12 SV_CONST_REG_2.13 SV_CONST_REG_2.14 SV_CONST_REG_2.15 SV_CONST_REG_2.16 SV_CONST_REG_2.23 SV_CONST_REG_2.25 SV_CONST_REG_2.27 SV_CONST_REG_2.29 SV_CONST_REG_2.31 SV_CONST_REG_2.33 SV_CREG_1.4 SV_CREG_1.6 SV_CREG_1.8 SV_CREG_1.10 SV_CREG_1.12 SV_CREG_1.14 SV_CREG_1.15 SV_CREG_1.17 SV_CREG_1.19 SV_CREG_1.21 SV_CREG_1.23 SV_CREG_1.25 SV_CREG_1.27 SV_EXT_3.3 SV_EXT_4.3 SV_EXT_4.4 SV_EXT_4.5 SV_EXT_4.6 SV_EXT_4.7 SV_EXT_4.8 SV_EXT_4.9 SV_EXT_4.10 SV_EXT_4.11 SV_EXT_4.12 SV_EXT_4.13 SV_EXT_4.14 SV_EXT_4.15 SV_EXT_4.16 SV_EXT_4.17 SV_EXT_4.18 SV_EXT_4.19 SV_EXT_4.20 SV_EXT_4.21 SV_EXT_4.22 SV_EXT_4.23 SV_EXT_4.24 SV_EXT_4.25 SV_EXT_4.26 SV_EXT_4.27 SV_EXT_4.28 SV_EXT_4.29 SV_EXT_4.30 SV_EXT_4.31 SV_EXT_4.32 SV_EXT_4.33 SV_EXT_4.34 SV_XFER_2.3 SV_XFER_2.5 SV_XFER_2.7 SV_XFER_2.9 SV_XFER_2.11 SV_XFER_2.12 SV_XFER_2.13 SV_XFER_2.14 SV_XFER_2.15 SV_XFER_2.16 SV_XFER_2.17 SV_XFER_2.18 SV_XFER_2.27 SV_XFER_3.3 SV_XFER_3.4 SV_XFER_3.5 SV_XFER_3.6 SV_XFER_3.7 SV_XFER_3.8 SV_XFER_3.9 SV_XFER_3.10 SV_XFER_3.11 SV_XFER_3.12 SV_XFER_3.13 SV_XFER_3.14 SV_XFER_3.15 SV_XFER_3.16 SV_XFER_3.17 SV_XFER_3.18 SV_XFER_3.19 SV_XFER_3.20 SV_XFER_3.21 SV_XFER_3.22 SV_XFER_3.23 SV_XFER_3.24 SV_XFER_3.25 SV_XFER_3.26 SV_XFER_3.27 SV_XFER_3.28 SV_XFER_3.29 SV_XFER_3.30 SV_XFER_3.31 SV_XFER_3.32 SV_XFER_3.33 SV_XFER_3.34 SV_XFER_4.3 SV_XFER_4.4 SV_XFER_4.5 SV_XFER_4.6 SV_XFER_4.7 SV_XFER_4.8 SV_XFER_4.9 SV_XFER_4.10 SV_XFER_4.11 SV_XFER_4.12 SV_XFER_4.13 SV_XFER_4.14 SV_XFER_4.15 SV_XFER_4.16 SV_XFER_4.17 SV_XFER_4.18 SV_XFER_4.19 SV_XFER_4.20 SV_XFER_4.21 SV_XFER_4.22 SV_XFER_4.23 SV_XFER_4.24 SV_XFER_4.25 SV_XFER_4.26 SV_XFER_4.27 SV_XFER_4.28 SV_XFER_4.29 SV_XFER_4.30 SV_XFER_4.31 SV_XFER_4.32 SV_XFER_4.33 SV_XFER_4.34

## Notes on the sheet
- Großer Cap, aber welcher

## Library data of the parts
C1 C2 = rcl:CPOL-EU: POLARIZED CAPACITOR, European symbol; SPICEPREFIX: C
R1-R64 = rcl:R-EU_: RESISTOR, European symbol; SPICEPREFIX: R
SV1_GPR_1 SV1_GPR_2 SV2_CREG_1 SV2_CREG_2 SV2_GPR_1 SV2_GPR_2 SV3_CREG_1 SV3_CREG_2 SV3_GPR_1 SV3_GPR_2 SV4_GPR_1 SV4_GPR_2 SV5_GPR_1 SV5_GPR_2 SV_BUS_CONTROL_1-SV_BUS_CONTROL_4 SV_CONST_REG_1 SV_CONST_REG_2 SV_CREG_1 SV_CREG_2 SV_XFER_1-SV_XFER_4 = con-lstb:MA18-2: PIN HEADER; OC_FARNELL: unknown; OC_NEWARK: unknown
SV_EXT_1-SV_EXT_4 = con-lstb:MA18-2W: PIN HEADER; OC_FARNELL: unknown; OC_NEWARK: unknown